# Altium schematic sheet Sheet3.SchDoc
size A3; SheetNumber: 1; SheetTotal: 1
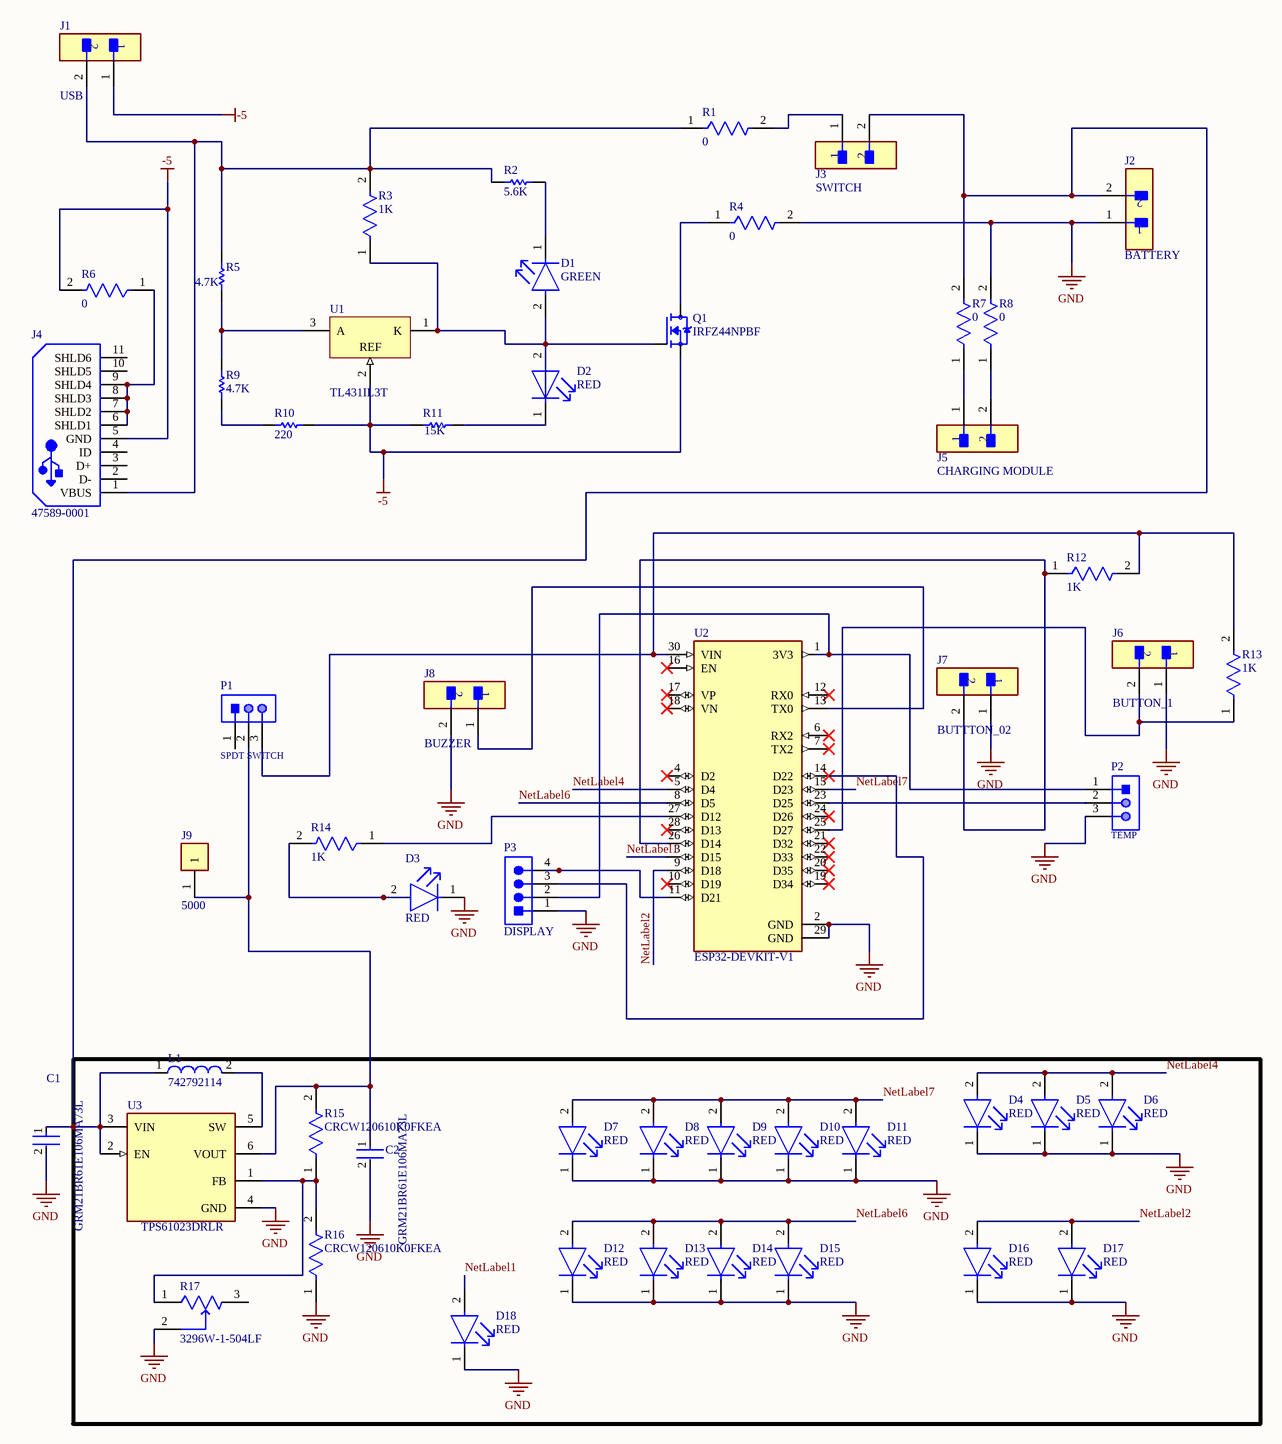
[diagram p0: Sheet3.SchDoc]

## Parts
C1  GRM21BR61E106MA73L  [FP-GRM21B-0_15-IPC_A]
C2  GRM21BR61E106MA73L  [FP-GRM21B-0_15-IPC_A]
D1  GREEN  [FP-HSMG-C150-MFG]
D2  RED  [FP-HSMS-C150-MFG]
D3  RED  [FP-HSMS-C150-MFG]
D4  RED  [FP-HSMS-C150-MFG]
D5  RED  [FP-HSMS-C150-MFG]
D6  RED  [FP-HSMS-C150-MFG]
D7  RED  [FP-HSMS-C150-MFG]
D8  RED  [FP-HSMS-C150-MFG]
D9  RED  [FP-HSMS-C150-MFG]
D10  RED  [FP-HSMS-C150-MFG]
D11  RED  [FP-HSMS-C150-MFG]
D12  RED  [FP-HSMS-C150-MFG]
D13  RED  [FP-HSMS-C150-MFG]
D14  RED  [FP-HSMS-C150-MFG]
D15  RED  [FP-HSMS-C150-MFG]
D16  RED  [FP-HSMS-C150-MFG]
D17  RED  [FP-HSMS-C150-MFG]
D18  RED  [FP-HSMS-C150-MFG]
J1  USB  [FP-61900211121-MFG]
J2  BATTERY  [FP-61900211121-MFG]
J3  SWITCH  [FP-61900211121-MFG]
J4  47589-0001  [MOLX-47589-0001_V]
J5  CHARGING MODULE  [FP-61900211121-MFG]
J6  BUTTON_1  [FP-61900211121-MFG]
J7  BUTTTON_02  [FP-61900211121-MFG]
J8  BUZZER  [FP-61900211121-MFG]
J9  5000  [FP-5000-MFG]
L1  742792114  [SMD-1206]
P1  SPDT SWITCH  [61900311121]
P2  TEMP  [61900311121]
P3  DISPLAY  [TECO-280371-2_V]
Q1  IRFZ44NPBF  [TO254P1016X419X2286-3]
R1  0  [FP-RC1206-MFG]
R2  5.6K  [RESC3216X70X50LL20T25]
R3  1K  [FP-CR1206-IPC_A]
R4  0  [FP-RC1206-MFG]
R5  4.7K  [RESC3216X70X50LL05T20]
R6  0  [FP-RC1206-MFG]
R7  0  [FP-RC1206-MFG]
R8  0  [FP-RC1206-MFG]
R9  4.7K  [RESC3216X70X50LL05T20]
R10  220  [RESC3216X70X50ML20T25]
R11  15K  [RESC3216X70X50NL05T20]
R12  1K  [FP-CR1206-IPC_A]
R13  1K  [FP-CR1206-IPC_A]
R14  1K  [FP-CR1206-IPC_A]
R15  CRCW120610K0FKEA  [FP-CRCW1206-e3-IPC_C]
R16  CRCW120610K0FKEA  [FP-CRCW1206-e3-IPC_C]
R17  3296W-1-504LF  [FP-3296W-MFG]
U1  TL431IL3T  [SOT23-3_L]
U2  ESP32-DEVKIT-V1  [MODULE_ESP32_DEVKIT_V1]
U3  TPS61023DRLR  [FP-DRL0006A-MFG]

## Nets
-5: J1.1 J4.5(GND) Q1.3(S) R6.2 R10.2 R11.1 U1.2(REF)
GND: C1.2 C2.2 D3.1(C) D4.1(C) D5.1(C) D6.1(C) D7.1(C) D8.1(C) D9.1(C) D10.1(C) D11.1(C) D12.1(C) D13.1(C) D14.1(C) D15.1(C) D16.1(C) D17.1(C) D18.1(C) J2.1 J6.1 J7.1 J8.2 P2.3 P3.1 R4.2 R8.2 R16.1 R17.2(WIPER) U2.2(GND) U2.29(GND) U3.4(GND)
NetLabel1: D18.2(A) U2.3(D15)
NetLabel2: D16.2(A) D17.2(A) U2.9(D18)
NetLabel4: D4.2(A) D5.2(A) D6.2(A) U2.5(D4)
NetLabel6: D12.2(A) D13.2(A) D14.2(A) D15.2(A) U2.8(D5)
NetLabel7: D7.2(A) D8.2(A) D9.2(A) D10.2(A) D11.2(A) U2.15(D23)
NetC1_1: C1.1 J2.2 J3.2 L1.1 R7.2 U3.2(EN) U3.3(VIN)
NetC2_1: C2.1 J9.1 P1.2 R15.2 U3.6(VOUT)
NetD1_1: D1.1(C) R2.2
NetD1_2: D1.2(A) D2.2(A) Q1.1(G) R3.1 U1.1(K)
NetD2_1: D2.1(C) R11.2
NetD3_2: D3.2(A) R14.2
NetJ1_2: J1.2 J4.1(VBUS) R1.1 R2.1 R3.2 R5.2
NetJ3_1: J3.1 R1.2
NetJ4_6: J4.6(SHLD1) J4.7(SHLD2) J4.8(SHLD3) J4.9(SHLD4) R6.1
NetJ5_1: J5.1 R7.1
NetJ5_2: J5.2 R8.1
NetJ6_2: J6.2 R13.1 U2.25(D27)
NetJ7_2: J7.2 R12.1 U2.26(D14)
NetJ8_1: J8.1 U2.13(TX0)
NetL1_2: L1.2 U3.5(SW)
NetP1_3: P1.3 R12.2 R13.2 U2.30(VIN)
NetP2_1: P2.1 P3.2 U2.1(3V3)
NetP2_2: P2.2 U2.23(D25)
NetP3_3: P3.3 U2.14(D22)
NetP3_4: P3.4 U2.11(D21)
NetQ1_2: Q1.2(D) R4.1
NetR5_1: R5.1 R9.2 U1.3(A)
NetR9_1: R9.1 R10.1
NetR14_1: R14.1 U2.27(D12)
NetR15_1: R15.1 R16.2 R17.1(CCW) U3.1(FB)

Not connected (* = marked no-connect by the designer): J4 2(D-) 3(D+) 4(ID) 10(SHLD5) 11(SHLD6); P1 1; R17 3(CW); U2 4(D2)* 6(RX2)* 7(TX2)* 10(D19)* 12(RX0)* 16(EN)* 17(VP)* 18(VN)* 19(D34)* 20(D35)* 21(D32)* 22(D33)* 24(D26)* 28(D13)*

## Library data of the parts
C1 C2 = CMP-06035-013048-1: Chip Multilayer Ceramic Capacitors for General Purpose, 0805, 10uF, X5R, 15%, 20%, 25V; Max Operating Temperature: 85°C; Package Quantity: 3000; Case/Package: 0805; Depth: 1.25mm; Case Code (Imperial): 0805; Termination: SMD/SMT; Width: 0.049inch; Packaging: Tape and Reel; Tolerance: 20%; Height: 1.25mm; Min Operating Temperature: -55°C; Capacitance: 10uF; Weight: 0.000335oz; Voltage Rating (DC): 25V; Dielectric: X5R; Length: 2mm; Thickness: 0.055inch; Voltage Rating: 25V; Resistor Type: Ceramic; Lead Free: Lead Free; Case Code (Metric): 2012; Mount: Surface Mount; REACH SVHC: No SVHC
D1 = CMP-2000-05061-2: LED GREEN DIFFUSED 1206 SMD; Manufacturer Part Number: HSMG-C150; Manufacturer: Broadcom; Led Orientation: Top View; Max Junction Temp: +95°C; Peak Emmision Wavelength: 570nm; Viewing Angle: 170°; Wavelength: 572nm; Reverse Voltage: 5V; Luminous Intensity: 15mcd; Description: Surface Mount Chip LEDs; Forward Voltage: 2.2V; Power Dissipation: 65mW; Forward Current: 20mA; ComponentLink2Description: Datasheet; Lead Free: Yes; Temperature Range Low: -40°C; Package: HSMG-C150; Digikey Description: LED GREEN DIFFUSED 1206 SMD; Mouser Description: LED Uni-Color Green 570nm 2-Pin Chip LED T/R; Temperature Range High: +85°C; Device Class L1: Optoelectronics; Colour: Green; Category: Diode; Device Class L3: unset; RoHS: TRUE; Height: 1.2mm; ComponentLink2URL: https://docs.broadcom.com/docs/AV02-0551EN; Device Class L2: LEDs; Automotive: No; Ipc Land Pattern Name: DIOCP320160X55; Octopart: https://octopart.com/hsmg-c150-broadcom-71131304; Temperature: -40°C to +85°C
D2-D18 = CMP-21615-000001-1: LED RED DIFFUSED CHIP SMD; Luminous Intensity: 10mcd; Power Dissipation: 65mW; Viewing Angle: 170°; Number of Elements: 1; Forward Current: 20mA; Lens Color: White; Lens Style: Rectangular; Wavelength: 626nm; Forward Voltage: 2.1V; Reverse Voltage: 5V; Number of Pins: 2; Color: Red; Lead Free: Lead Free; Width: 1.6mm; Length: 3.2mm; REACH SVHC: No SVHC; Height: 1.1mm; Depth: 1.6mm; Power Rating: 65mW; Package Quantity: 1; Illumination Color: Red; Radiation Hardening: No; Case Code (Imperial): 1206; Max Operating Temperature: 85°C; Test Current: 20mA; Case/Package: 1206; Lens Transparency: Diffused; Number of LEDs: 1; Packaging: Tape and Reel; Mount: Surface Mount; Min Operating Temperature: -40°C; Case Code (Metric): 3216; Dominant Wavelength: 626nm
J1-J3 J5-J8 = CMP-1502-00584-2: CONN HEADER VERT 2POS 2.54MM; Number of Contacts: 2; Gender: Male; Current Rating: 3A; Voltage Rating: 250V; Insulation Resistance: 1GR; Contact Material: Copper Alloy; Package Quantity: 1000; Color: Beige; Mount: Through Hole; Termination: Through Hole; Fastening Type: Friction; Contact Mating Length: 0.295inch; Pitch: 2.54mm; Max Operating Temperature: 105°C; Height: 14.2mm; RoHS Compliant: Yes; Packaging: Bulk; Contact Type: Male Pin; Width: 5.12mm; Housing Material: Nylon; Min Operating Temperature: -40°C; Insulation Material: Nylon; Contact Finish - Mating: TIN; Insulation Color: Beige; Contact Plating: Tin; Flammability Rating: UL94 V-0; Length: 5.8mm; Contact Gender: Male; Connector Type: Header; Contact Shape: Square; Series: WR-WTB; Number of Positions: 2; Number of Rows: 1
J4 = CMP-2000-05610-1: Right Angle Female Type AB Micro USB Connector, 30 V, 1.8 A, -30 to 85 degC, RoHS, Tape and Reel; Number of Ports: 1Port; Current Rating: 1.8A; Brand: Molex; Connector Type: MicroUSBTypeABreceptacle; Number of Contacts: 5Contact; Voltage Rating: 30VAC; Color: Black; Product: MicroUSBTypeABConnectors; Package URL: http://www.molex.com/pdm_docs/sd/475890001_sd.pdf; Contact Plating: Gold; Datasheet URL: http://www.molex.com/webdocs/datasheets/pdf/en-us/0475890001_IO_CONNECTORS.pdf; Operating Temperature Range: -20Cto+85C; Termination Style: SMD/SMT; Mounting Angle: Right; Package Reference: 47589-0001; Gender: Female; Package Description: Micro USB Connector, Pitch 0.65 mm, 5 Positions, Body 7.5 x 5.6 mm; Mounting Technology: SurfaceMount; Contact Material: CopperAlloy; Packaging: Reel; RoHS: True; Standard: USB; Manufacturer URL: http://www.molex.com/; Manufacturer: Molex; Datasheet Version: 12/2016; Product Category: USBConnectors; Series: 47589
J9 = CMP-19636-000027-1: PC TEST POINT MINIATURE RED; Outside Diameter: 2.54mm; Body Material: Bronze; Number of Contacts: 1; Insulation: Insulated; Inside Diameter: 1.27mm; Hole Diameter: 1.6mm; Plating: Silver; Length: 7.62mm; Package Quantity: 100; Number of Ports: 1; Contact Material: Bronze; Orientation: Straight; RoHS Compliant: Yes; Housing Color: Red; Height: 0.3inch; Series: THM; Lead Free: Lead Free; Color: Red; Contact Plating: Tin; Mount: PCB; Packaging: Bulk; REACH SVHC: No SVHC; Flammability Rating: UL94 V-0; Material: Nylon
L1 = CMP-0220-00021-1: SMD EMI Suppression Ferrite Bead WE-CBF, Z = 50 Ohm; Impedance: 50 Ohm; PackageDescription: Chip Inductor, 2-Leads, Body 3.2 x 1.6 mm; ComponentLink1URL: http://www.we-online.com; ComponentLink2URL: http://www.we-online.de/katalog/media/pdf/742792114.pdf; ComponentLink2Description: Datasheet; ComponentLink1Description: Manufacturer Link; DatasheetVersion: Dec-2005; PackageReference: SMD-1206; PackageVersion: 2007
P1 P2 = CMP-1502-00585-1: Male Locking Header WR-WTB, THT, Vertical, pitch 2.54 mm, 1 x 3 position; Manufacturer: Wurth Elektronik; Contact Resistance: 20mOhm; Pitch: 2.54mm; Working Voltage: 250VAC; Position: 1x3; Mounting Technology: THT; Operating Temperature: -40to105degC; Part Number: 61900311121; Datasheet URL: https://katalog.we-online.de/em/datasheet/6190xx11121.pdf; Manufacturer URL: http://www.we-online.de; Publisher: WurthElektronik; Orientation: Vertical; Gender: Male; Package Reference: 61900311121; Packaging: Bag
P3 = CMP-2000-05548-1: Male Header, Pitch 2.54 mm, 1 x 4 Position, Height 12.8 mm, Tail Length 3.5 mm, -55 to 105 degC, RoHS, Bulk; Manufacturer: TE Connectivity; Pitch: 0.100"(2.54mm); Connector Type: Header,Shrouded; Other Names: 280371-2-ND / A106401; Number of Positions Loaded: All; Dynamic Catalog: AMPMODUModIISeries; Number of Positions: 4; 3D Model: 280371-2.pdf; Termination: Solder; Package Description: Male Header, Pitch 2.54 mm, 1 x 4 Position, Height 12.8 mm, Tail Length 3.5 mm; Datasheet Version: Rev. M1, 08/2016; Contact Mating Length: 0.260"(6.60mm); Datasheet URL: http://www.te.com/commerce/DocumentDelivery/DDEController?Action=showdoc&DocId=Customer+Drawing%7F280370%7FM1%7Fpdf%7FEnglish%7FENG_CD_280370_M1.pdf%7F280371-2; Mounting Technology: ThroughHole; Standard Package: 1,000; Contact Finish Thickness: 15µin(0.38µm); Contact Finish: Gold; Contact Type: MalePin; Packaging: Bulk; Mounting Type: ThroughHole; Number of Rows: 1; Family: RectangularConnectors-Headers,MalePins; Manufacturer URL: http://www.te.com/; Color: Black; RoHS Information: 280371-2StatementofCompliance; Package Reference: 280371-2; Category: Connectors,Interconnects; Series: AMPMODUModII
Q1 = IRFZ44NPBF: N-Channel 55 V 49A (Tc) 94W (Tc) Through Hole TO-220AB; MF: Infineon; Purchase-URL: https://pricing.snapeda.com/search/part/IRFZ44NPBF/?ref=eda; SnapEDA_Link: https://www.snapeda.com/parts/IRFZ44NPBF/Infineon+Technologies/view-part/?ref=snap; Value: *; MP: IRFZ44NPBF; Package: TO-220-3 Infineon; Digi-Key_Part_Number: IRFZ44NPBF-ND; Check_prices: https://www.snapeda.com/parts/IRFZ44NPBF/Infineon+Technologies/view-part/?ref=eda
R1 R4 R6-R8 = CMP-2100-03681-2: RES SMD 0 OHM JUMPER 1/4W 1206; Manufacturer Part Number: RC1206JR-070RL; Manufacturer: YAGEO; Voltage Rating: 200V; Temperature Coefficient: 300ppm/°C; Power Rating: 0.25W; Value: 0Ω; Description: 0 Ohms Jumper 0.25W, 1/4W Chip Resistor 1206 (3216 Metric) Moisture Resistant Thick Film; Tolerance: 5%; Temperature Range Low: -55°C; Category: Res; Automotive: No; Ipc Land Pattern Name: RESC310160X55; Device Class L1: Passive Components; Temperature: -55°C to +155°C; ComponentLink2URL: https://www.yageo.com/upload/media/product/productsearch/datasheet/rchip/PYu-RC_Group_51_RoHS_L_10.pdf; Lead Free: Yes; Height: 0.65mm; Footprint Url: https://www.yageo.com/upload/website/yageo_PYu-R_Mount_10_19050818_343.pdf; Package: RC1206; Digikey Description: RES SMD 0 OHM JUMPER 1/4W 1206; Temperature Range High: +155°C; Device Class L3: Chip SMD Resistors; Device Class L2: Resistors; Octopart: https://octopart.com/rc1206jr-070rl-yageo-40025601; Resistance: 0Ω; Series: RC; ComponentLink2Description: Datasheet; Composition: Thick Film; RoHS: TRUE; Mouser Description: Resistor: thick film; SMD; 1206; 0O; 0.25W; ±5%; -55÷155°C
R2 = CMP-2003-04481-1: Manufacturer: Panasonic; Part Number: ERA8AEB562V
R3 R12-R14 = CMP-07231-002641-1: Thick Film Chip Resistors 1206 1kΩ 0.25W 1% 100ppm/°C; Voltage Rating: 200V; Max Power Dissipation: 250mW; Resistance: 1kR; REACH SVHC: No SVHC; Radiation Hardening: No; Number of Terminations: 2; Max Operating Temperature: 155°C; Temperature Coefficient: 100ppm/°C; Voltage Rating (DC): 200V; Tolerance: 1%; Composition: Thick Film; Case Code (Imperial): 1206; Mount: Surface Mount; Width: 1.6mm; Min Operating Temperature: -55°C; Height: 0.6mm; Packaging: Tape and Reel; Number of Pins: 2; Package Quantity: 1; Military Standard: Not; Length: 3.2mm; Thickness: 610um; Case Code (Metric): 3216; Case/Package: 1206; Contact Plating: Tin; Power Rating: 250mW; Termination: SMD/SMT; Depth: 1.6mm; Features: Moisture Resistant
R5 R9 = CMP-2003-00848-1: Part Number: ERJ8ENF4701V; Manufacturer: Panasonic
R10 = CMP-2003-04438-1: Part Number: ERA8AEB221V; Manufacturer: Panasonic
R11 = CMP-2003-00118-1: Manufacturer: Panasonic; Part Number: ERJ-8ENF1502V
R15 R16 = CMP-2003-04807-2: RES Thick Film, 10kΩ, 1%, 0.25W, 100ppm/°C, 1206; Working Voltage: 200V; Max Power Dissipation: 250mW; Resistance: 10kR; Tolerance: 1%; Width: 0.063inch; Height: 0.55mm; Number of Pins: 2; Voltage Rating: 200V; Temperature Coefficient: 100ppm/°C; Military Standard: Not; Features: Automotive AEC-Q200; Depth: 1.6mm; Radiation Hardening: No; Termination: SMD/SMT; Case Code (Imperial): 1206; Weight: 0.000353oz; Length: 3.2mm; Package Quantity: 10; Voltage Rating (DC): 200V; Case/Package: 1206; Min Operating Temperature: -55°C; Number of Terminations: 2; Composition: Thick Film; Contact Plating: Tin; Power Rating: 250mW; Packaging: Tape and Reel; Max Operating Temperature: 155°C; Lead Free: Lead Free; Case Code (Metric): 3216
R17 = CMP-2000-05583-2: TRIMMER 500K OHM 0.5W PC PIN TOP; Manufacturer: Bourns; Description: 500 kOhms 0.5W, 1/2W PC Pins Through Hole Trimmer Potentiometer Cermet 25 Turn Top Adjustment; Resistance: 500kΩ; Temperature Coefficient: 100ppm/°C; Value: 500kΩ; Tolerance: 10%; Voltage Rating: 300V; Standoff Height: 0.38mm; ComponentLink2Description: Datasheet; Package: 3296W; Series: Trimpot 3296-Sealed; Lead Free: Yes; Octopart: https://octopart.com/3296w-1-504lf-bourns-143884; Device Class L2: Resistors; Automotive: No; RoHS: TRUE; Temperature Range High: +125°C; Manufacturer Part Number: 3296W-1-504LF; Height: 12.05mm; Power Rating: 0.5W; Temperature Range Low: -55°C; ComponentLink2URL: https://www.bourns.com/docs/Product-Datasheets/3296.pdf; Device Class L1: Passive Components; Device Class L3: Variable Resistors and Potentiometers; Category: Res; Temperature: -55°C to +125°C; Digikey Description: TRIMMER 500K OHM 0.5W PC PIN TOP; Mouser Description: Trimmer; Cermet; Rest 500 Kilohms; PCB; 25 Turns; Pwr-Rtg 0.5W
U1 = CMP-0242-00062-1: Programmable Voltage Reference, 2.5 to 36V, 3-Pin SOT23-3, Tape and Reel; ComponentLink1Description: Manufacturer URL; ComponentLink2URL: http://www.st.com/internet/com/TECHNICAL_RESOURCES/TECHNICAL_LITERATURE/DATASHEET/CD00000986.pdf; DatasheetVersion: Oct-2011; PackageReference: SOT23-3; PackageDescription: 3-Pin SOT-23 Package 0.95 mm Pitch, 2.4 mm Lead Span; ComponentLink2Description: Datasheet; PackageVersion: 2011; ComponentLink1URL: http://www.st.com
U2 = ESP32-DEVKIT-V1: Dual core, Wi-Fi: 2.4 GHz up to 150 Mbits/s,BLE (Bluetooth Low Energy) and legacy Bluetooth, 32 bits, Up to 240 MHz; MF: Do it; Price: None; Availability: Not in stock; Package: None; MP: ESP32-DEVKIT-V1; Value: *; SnapEDA_Link: https://www.snapeda.com/parts/ESP32-DEVKIT-V1/Do+it/view-part/?ref=snap; Check_prices: https://www.snapeda.com/parts/ESP32-DEVKIT-V1/Do+it/view-part/?ref=eda
U3 = CMP-04918-000638-1: FINISH GOODS FOR TPS61023